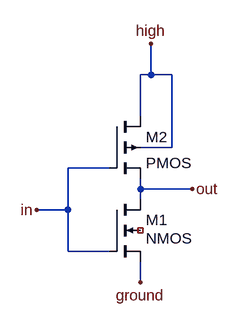
[diagram p0: schematic NOT.asc]
NOT.asc, the LTspice schematic file:
Version 4
SHEET 1 880 680
WIRE 176 -64 176 -112
WIRE 176 -64 160 -64
WIRE 208 -64 176 -64
WIRE 160 0 160 -64
WIRE 208 48 208 -64
WIRE 208 48 160 48
WIRE 112 80 48 80
WIRE 160 112 160 96
WIRE 240 112 160 112
WIRE 160 128 160 112
WIRE 48 144 48 80
WIRE 48 144 0 144
WIRE 48 208 48 144
WIRE 112 208 48 208
WIRE 160 256 160 224
FLAG 0 144 in
FLAG 240 112 out
FLAG 160 256 ground
FLAG 176 -112 high
SYMBOL nmos4 112 128 R0
WINDOW 3 56 60 Left 2
SYMATTR InstName M1
SYMBOL pmos4 112 0 R0
SYMATTR InstName M2

The netlist it stands for:
* NOT.asc
M1 out in ground NC_01 NMOS
M2 high in out high PMOS
.model NMOS NMOS
.model PMOS PMOS
.lib standard.mos
.backanno
.end